# EAGLE design q4 (EAGLE 9.6.2)
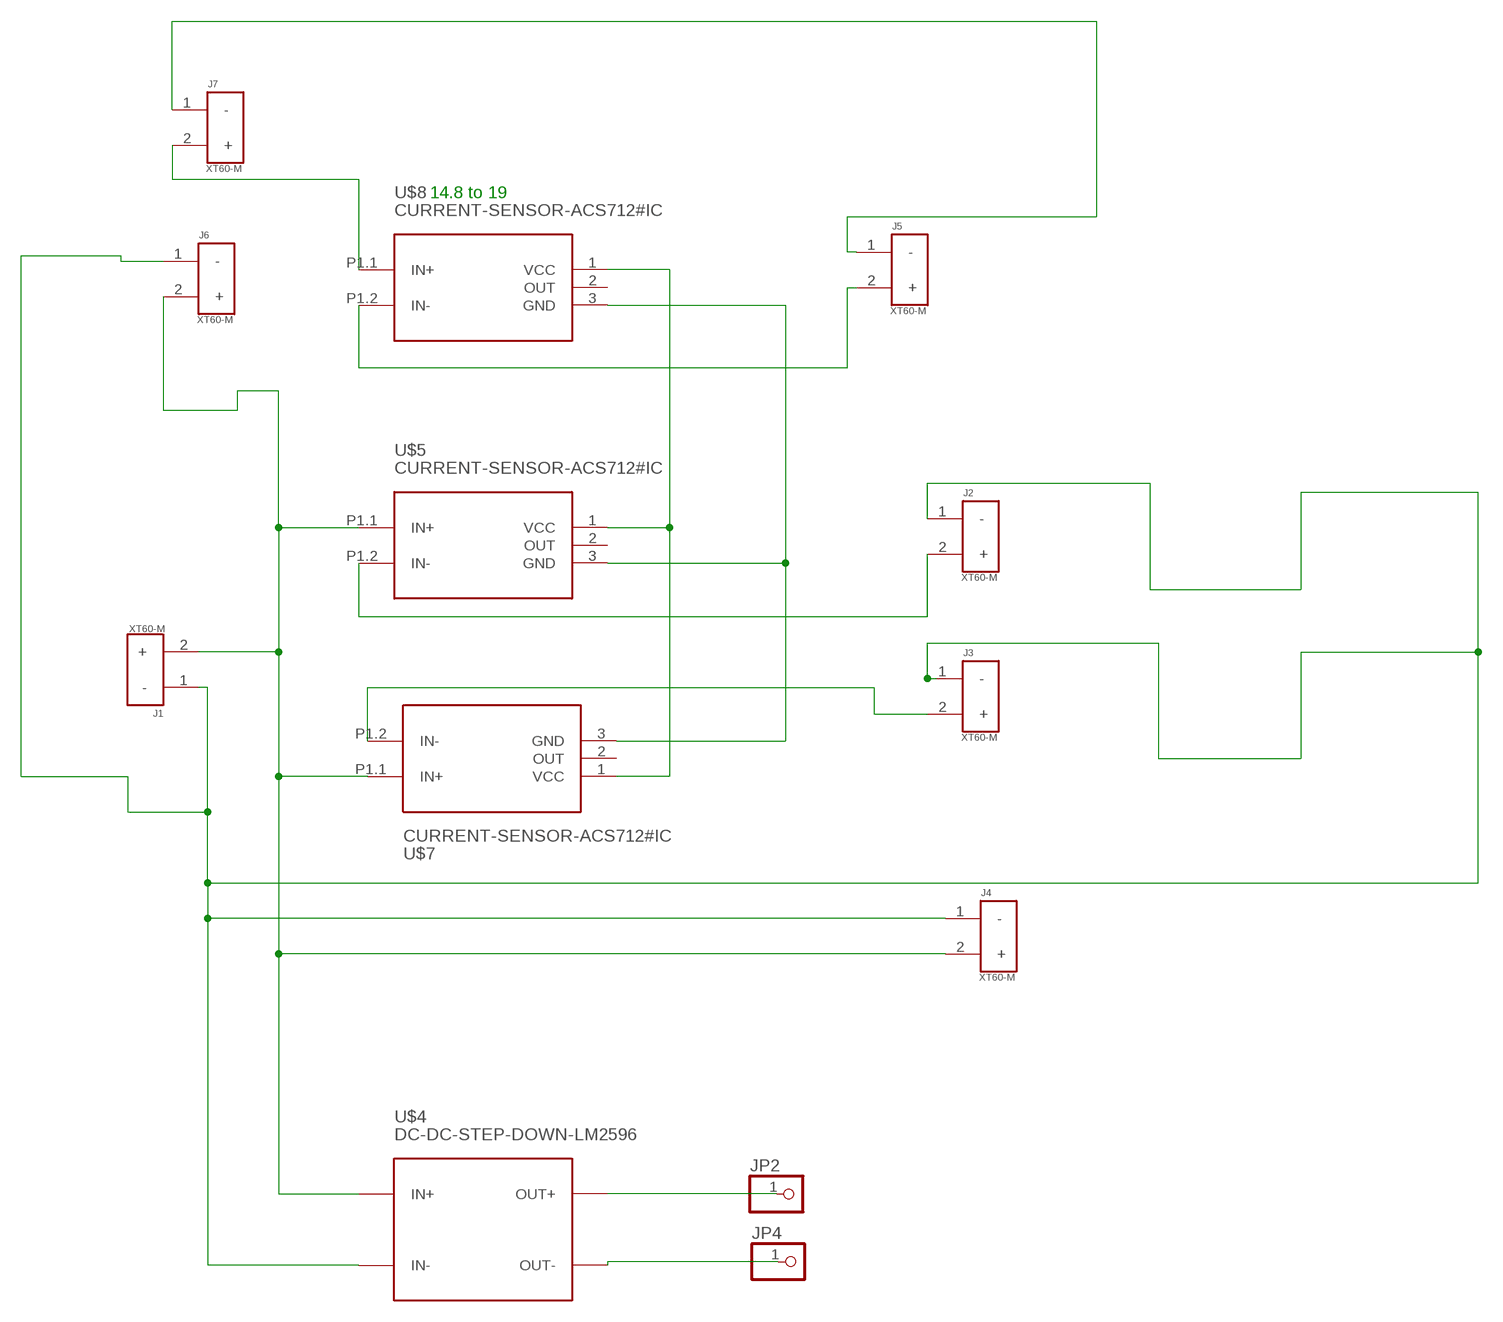
[diagram p0: schematic, sheet 1]

## Parts
J1  XT60-M  [AMASS_XT60-M]
J2  XT60-M  [AMASS_XT60-M]
J3  XT60-M  [AMASS_XT60-M]
J4  XT60-M  [AMASS_XT60-M]
J5  XT60-M  [AMASS_XT60-M]
J6  XT60-M  [AMASS_XT60-M]
J7  XT60-M  [AMASS_XT60-M]
JP2  PINHD-1X1  [1X01]
JP4  PINHD-1X1  [1X01]
U$4  DC-DC-STEP-DOWN-LM2596  [DC-DC-STEP-DOWN-LM2596]
U$5  CURRENT-SENSOR-ACS712#IC  [CURRENT-SENSOR-ACS712#IC]
U$7  CURRENT-SENSOR-ACS712#IC  [CURRENT-SENSOR-ACS712#IC]
U$8  CURRENT-SENSOR-ACS712#IC  [CURRENT-SENSOR-ACS712#IC]

## Nets
N$1: J7.2(+) U$8.P1.1(IN+)
N$2: J1.1(-) J2.1(-) J3.1(-) J4.1(-) J6.1(-) U$4.IN-
N$3: J5.1(-) J7.1(-)
N$4: J1.2(+) J4.2(+) J6.2(+) U$4.IN+ U$5.P1.1(IN+) U$7.P1.1(IN+)
N$5: J2.2(+) U$5.P1.2(IN-)
N$6: JP4.1 U$4.OUT-
N$9: J3.2(+) U$7.P1.2(IN-)
N$11: J5.2(+) U$8.P1.2(IN-)
N$16: JP2.1 U$4.OUT+
N$31: U$5.1(VCC) U$7.1(VCC) U$8.1(VCC)
N$38: U$5.3(GND) U$7.3(GND) U$8.3(GND)
Unconnected: U$5.2(OUT) U$7.2(OUT) U$8.2(OUT)

## Notes on the sheet
- 14.8 to 19

## Library data of the parts
J1-J7 = XT60-M:XT60-M: DC supply; XT60; male; PIN:2; for cable; soldered; 60A; 500V; AVAILABILITY: Unavailable; DESCRIPTION: Plug; DC supply; XT60; male; PIN: 2; for cable; soldered; 30A; 500V; MF: AMASS; MP: XT60-M; PACKAGE: Package Analog Devices; PRICE: None
JP2 JP4 = pinhead:PINHD-1X1: PIN HEADER
U$4 = diy-modules:DC-DC-STEP-DOWN-LM2596: DC/DC Step-Down Regulator based on LM2596-ADJ chip LM2596 datasheet available here: http://www.ti.com/lit/ds/symlink/lm2596.pdf Click here to find device on ebay.com <http://www.ebay.com/sch/lm2596+power+regulator>
U$5 U$7 U$8 = diy-modules:CURRENT-SENSOR-ACS712#IC: Isolated Bipolar Current Sensors based on ACS712 chip Symbol with input pins More details available here: http://embedded-lab.com/blog/a-brief-overview-of-allegro-acs712-current-sensor-part-1/ Click here to find device on ebay.com <http://www.ebay.com/sch/acs712+module> Note: There are many available versions with different pinout. Please check before use

## Board
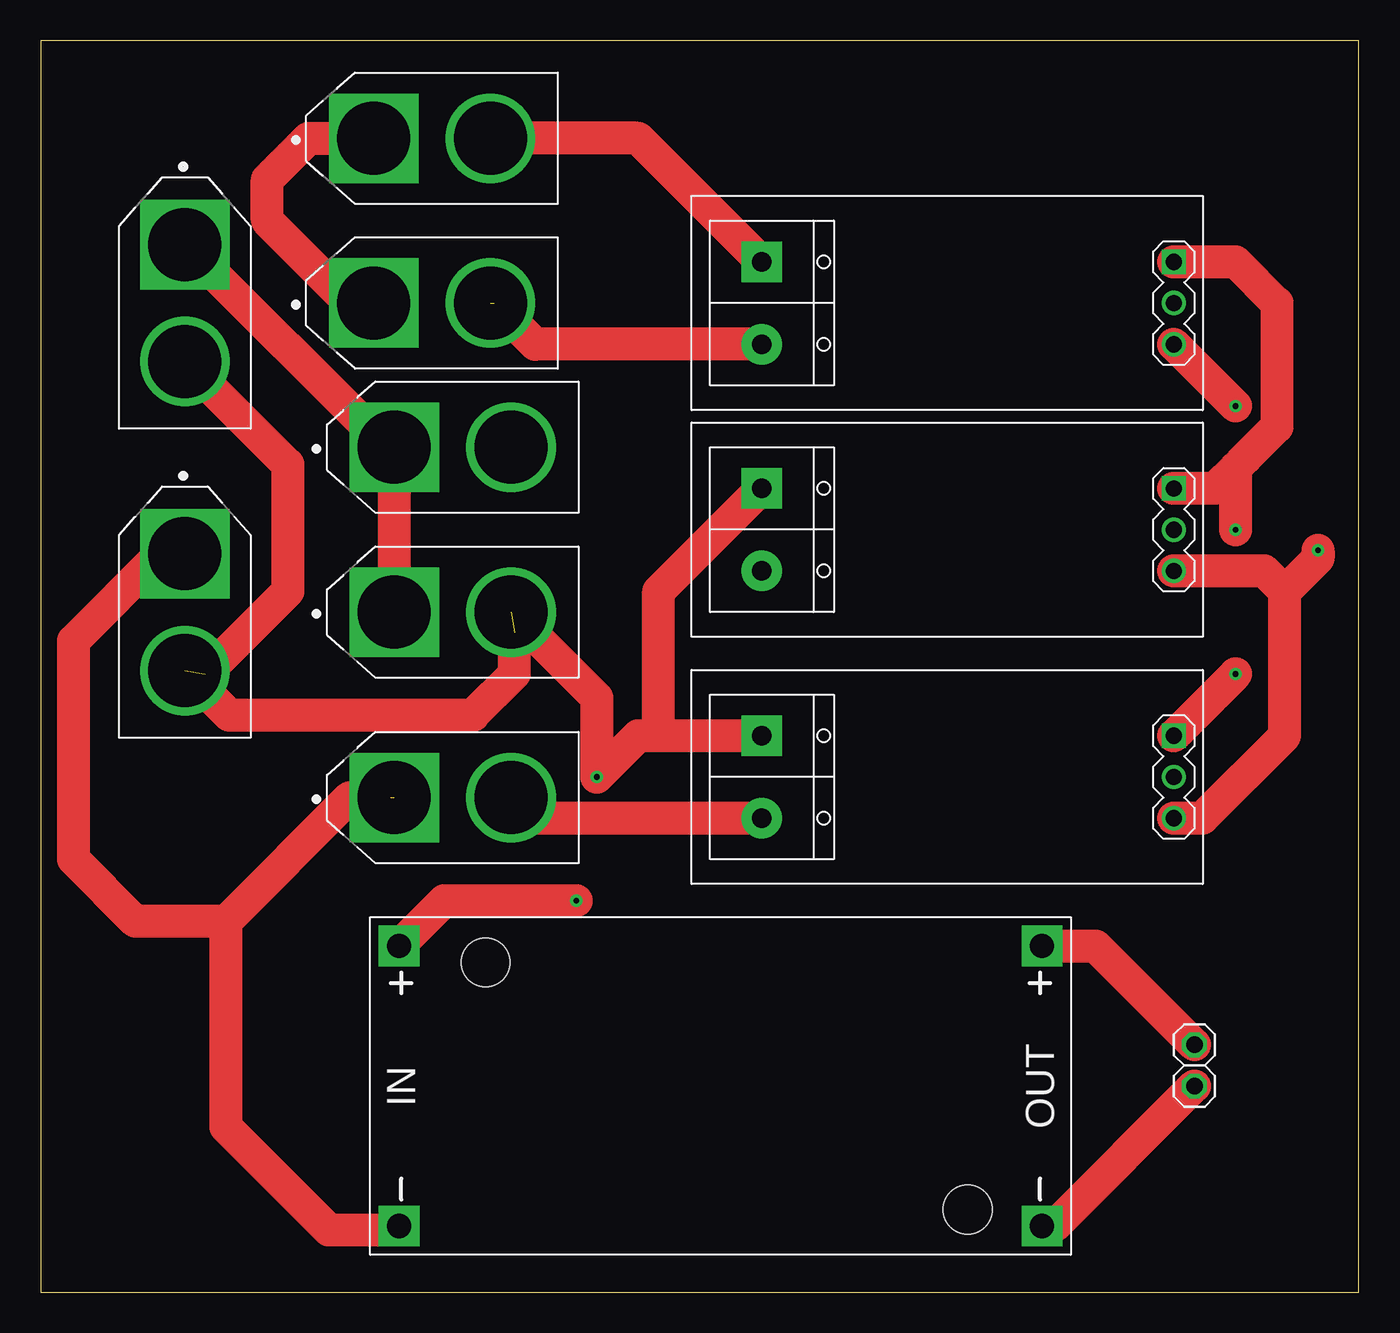
[diagram p1: board, top side]
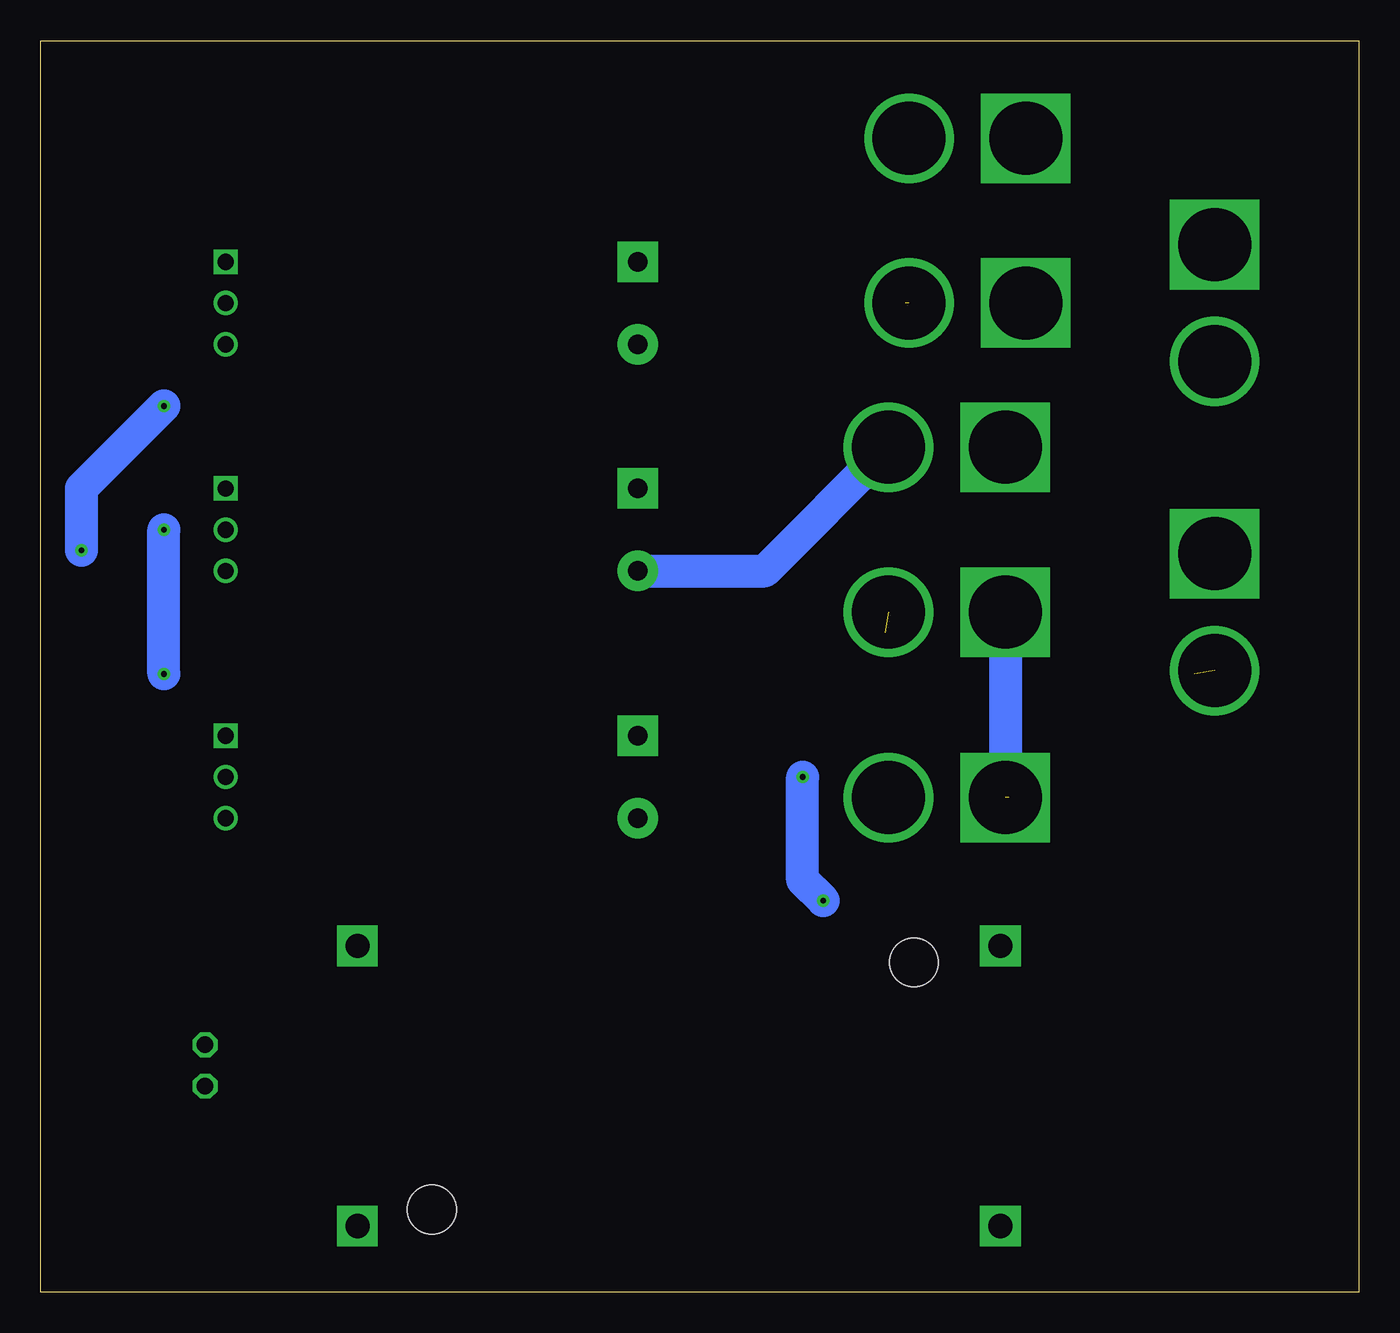
[diagram p2: board, bottom side, seen from below]

Size 81.26 x 77.14 mm. Coordinates in mm from the lower left corner, seen from the top.
Outline: 0,0 81.26,0 81.26,77.14 0,77.14 0,0
Copper layers (1*16): Top 0.035mm / dielectric 1.5mm / Bottom 0.035mm
Design rules "default": minimum track width 6mil, minimum drill 0.35mm, track to track 6mil, track to pad 6mil, pad to pad 6mil, via to via 6mil, smd to smd 6mil, copper to edge 40mil, drill to drill 6mil, minimum pad ring 10mil, minimum via ring 8mil, stop-mask expansion 4mil, vias tented up to drill 0mil, thermal gap 10mil

### Footprints (pad centres in the part's own frame; a part is rotated, then mirrored left to right if it is on the bottom)
AMASS_XT60-M = drill 4.5 square: 1 -3.6,0 | drill 4.5: 2 3.6,0
1X01 = drill 1.016 octagon: 1 0,0
DC-DC-STEP-DOWN-LM2596 = drill 1.5 pad 2.5 square: IN+ -19.812,8.636; IN- -19.812,-8.636; OUT+ 19.812,8.636; OUT- 19.812,-8.636 | hole 3: -14.478,7.62; 15.24,-7.62
CURRENT-SENSOR-ACS712#IC = drill 1 square: 1 13.97,2.54 | drill 1: 2 13.97,0; 3 13.97,-2.54 | drill 1.2 pad 2.5 square: P1.1 -11.43,2.54 | drill 1.2 pad 2.5: P1.2 -11.43,-2.54

### Placement (x,y rotation side)
J1  25.4,41.91 0 top
J2  25.4,30.48 0 top
J3  25.4,52.07 0 top
J4  8.89,41.91 270 top
J5  24.13,60.96 0 top
J6  8.89,60.96 270 top
J7  24.13,71.12 0 top
JP2  71.12,15.24 0 top
JP4  71.12,12.7 0 top
U$4  41.91,12.7 0 top
U$5  55.88,31.75 0 top
U$7  55.88,46.99 0 top
U$8  55.88,60.96 0 top

### Tracks (layer width: path | path; a pad name or v marks a point on that pad's centre or on a via)
N$1
  Top 2.032: U$8.P1.1 36.83,71.12 J7.2
N$2  (1 unrouted)
  Top 2.032: U$4.IN- 21.84,3.81 17.78,3.81 11.43,10.16 11.43,22.86 | 11.43,22.86 19.05,30.48 21.59,30.48 | 11.43,22.86 5.84,22.86 2.03,26.67 2.03,40.13 7.41,45.51 J4.1 | J6.1 21.38,52.07 J3.1 J1.1
  Bottom 2.032: J1.1 J2.1
N$3
  Top 2.032: J5.1 19.05,60.96 13.97,66.04 13.97,68.58 16.51,71.12 J7.1
N$4  (via drill 0.35)  (2 unrouted)
  Top 2.032: U$5.P1.1 38.1,34.29 | 38.1,34.29 38.1,43.18 U$7.P1.1 | U$4.IN+ 24.89,24.13 v33.02,24.13 | J6.2 15.24,51.01 15.24,43.18 10.16,38.1 | J4.2 11.64,35.56 26.67,35.56 29.21,38.1 29.21,40.64 | 38.1,34.29 36.83,34.29 v34.29,31.75 34.29,36.62 J1.2
  Bottom 2.032: v33.02,24.13 34.29,25.4 v34.29,31.75
N$5
  Top 2.032: J2.2 30.27,29.21 U$5.P1.2
N$6
  Top 2.032: U$4.OUT- 62.48,4.06 JP4.1
N$9
  Bottom 2.032: J3.2 36.62,44.45 U$7.P1.2
N$11  (1 unrouted)
  Top 2.032: U$8.P1.2 30.48,58.42 27.94,60.96
N$16
  Top 2.032: U$4.OUT+ 65.02,21.34 JP2.1
N$31  (via drill 0.35)
  Top 2.032: U$8.1 73.66,63.5 76.2,60.96 76.2,53.34 74.3,51.44 73.66,50.8 | U$7.1 72.39,49.53 73.66,50.8 | U$5.1 v73.66,38.1 | v73.66,46.99 73.66,50.8
  Bottom 2.032: v73.66,38.1 v73.66,46.99
N$38  (via drill 0.35)
  Top 2.032: U$5.3 71.61,29.21 76.69,34.29 76.69,43.18 | 76.69,43.18 75.42,44.45 U$7.3 | U$8.3 v73.66,54.61 | v78.74,45.72 78.74,45.23 76.69,43.18
  Bottom 2.032: v73.66,54.61 78.74,49.53 v78.74,45.72